# EAGLE design XBee-Explorer (EAGLE 6.5.0)
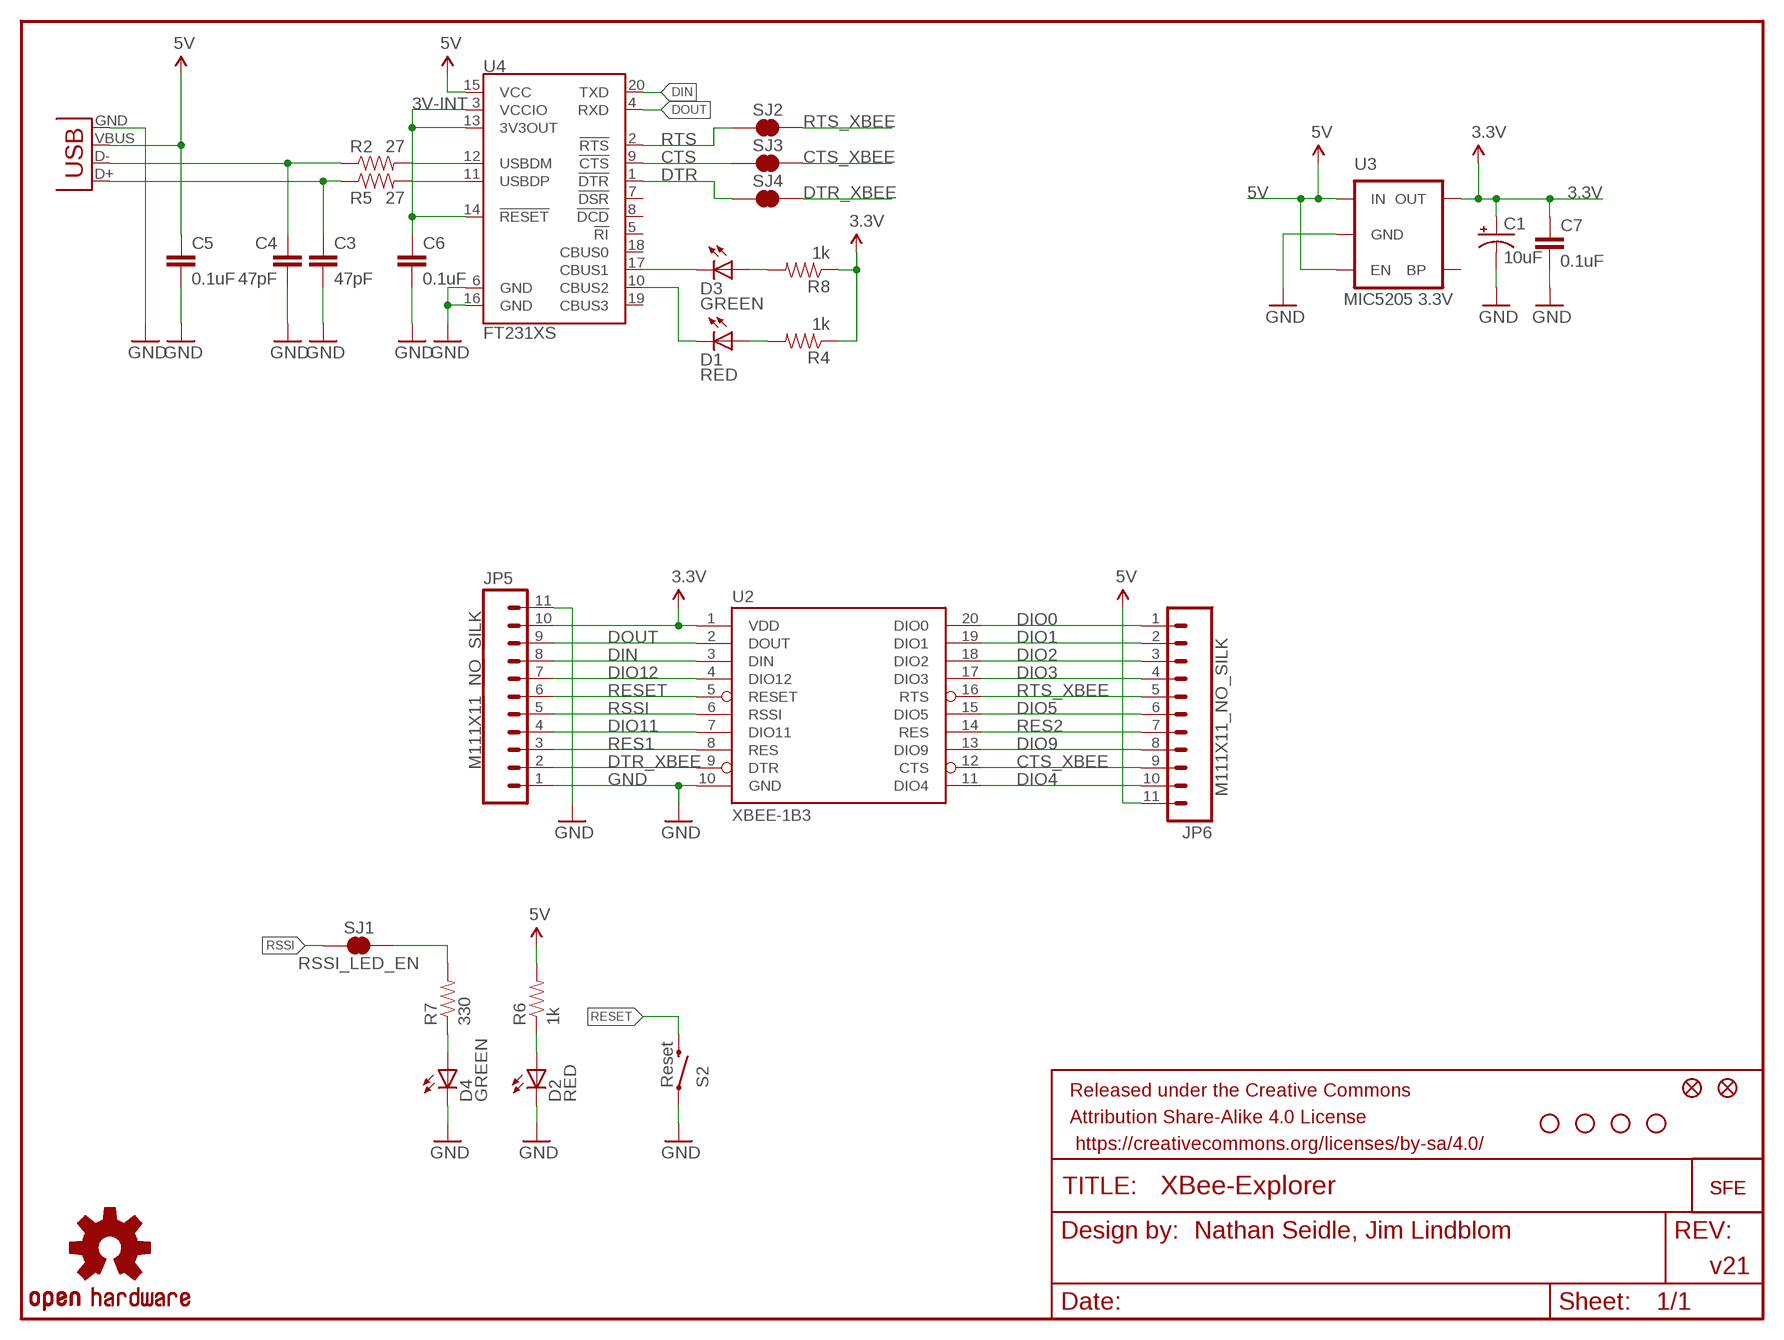
[diagram p0: schematic, sheet 1]

## Parts
C1  10uF  CAP_POL1206  [EIA3216]
C3  47pF  CAP0603-CAP  [0603-CAP]
C4  47pF  CAP0603-CAP  [0603-CAP]
C5  0.1uF  CAP0603-CAP  [0603-CAP]
C6  0.1uF  CAP0603-CAP  [0603-CAP]
C7  0.1uF  CAP0603-CAP  [0603-CAP]
D1  RED  LED-RED0603  [LED-0603]
D2  RED  LED-RED0603  [LED-0603]
D3  GREEN  LED-GREEN0603  [LED-0603]
D4  GREEN  LED-GREEN0603  [LED-0603]
FRAME1  FRAME-LETTER  [CREATIVE_COMMONS]
JP1  FIDUCIAL1X2  [FIDUCIAL-1X2]
JP4  FIDUCIAL1X2  [FIDUCIAL-1X2]
JP5  M111X11_NO_SILK  [1X11_NO_SILK]
JP6  M111X11_NO_SILK  [1X11_NO_SILK]
LOGO1  OSHW-LOGOS  [OSHW-LOGO-S]
R2  27  RESISTOR0603-RES  [0603-RES]
R4  1k  RESISTOR0603-RES  [0603-RES]
R5  27  RESISTOR0603-RES  [0603-RES]
R6  1k  RESISTOR0603-RES  [0603-RES]
R7  330  RESISTOR0603-RES  [0603-RES]
R8  1k  RESISTOR0603-RES  [0603-RES]
S2  Reset  SWITCH-MOMENTARY-2SMD  [TACTILE_SWITCH_SMD]
SJ1  RSSI_LED_EN  SOLDERJUMPERTRACE  [SJ_2S-TRACE]
SJ2  CTS_EN  SOLDERJUMPERTRACE  [SJ_2S-TRACE]
SJ3  RTS_EN  SOLDERJUMPERTRACE  [SJ_2S-TRACE]
SJ4  DTR  SOLDERJUMPERTRACE  [SJ_2S-TRACE]
U2  XBEE-1B3  [XBEE-SMD]
U3  MIC5205 3.3V  V_REG_LDOSMD  [SOT23-5]
U4  FT231XS  [SSOP20_L]
U$1  LOGO-SFESK  [SFE-LOGO-FLAME]
U$4  LOGO-SFENEW  [SFE-NEW-WEBLOGO]
U$5  STAND-OFF  [STAND-OFF]
U$9  STAND-OFF  [STAND-OFF]
U$10  STAND-OFF  [STAND-OFF]
U$11  STAND-OFF  [STAND-OFF]
X1  USBSMD  [USB-MINIB]

## Nets
3.3V: C1.A(+) C7.1 JP5.10 R4.1 R8.1 U2.1(VDD) U3.5(OUT)
3V-INT: C6.1 U4.3(VCCIO) U4.13(3V3OUT) U4.14(!RESET)
5V: C5.1 JP6.11 R6.2 U3.1(IN) U3.3(EN) U4.15(VCC) X1.VBUS
CTS: SJ3.1 U4.9(!CTS)
CTS_XBEE: JP6.9 SJ3.2 U2.12(CTS)
DIN: JP5.8 U2.3(DIN) U4.20(TXD)
DIO0: JP6.1 U2.20(DIO0)
DIO1: JP6.2 U2.19(DIO1)
DIO2: JP6.3 U2.18(DIO2)
DIO3: JP6.4 U2.17(DIO3)
DIO4: JP6.10 U2.11(DIO4)
DIO5: JP6.6 U2.15(DIO5)
DIO9: JP6.8 U2.13(DIO9)
DIO11: JP5.4 U2.7(DIO11)
DIO12: JP5.7 U2.4(DIO12)
DOUT: JP5.9 U2.2(DOUT) U4.4(RXD)
DTR: SJ4.1 U4.1(!DTR)
DTR_XBEE: JP5.2 SJ4.2 U2.9(DTR)
GND: C1.C(-) C3.2 C4.2 C5.2 C6.2 C7.2 D2.C D4.C JP5.1 JP5.11 S2.1 U2.10(GND) U3.2(GND) U4.6(GND) U4.16(GND) X1.GND
N$1: D1.A R4.2
N$2: D4.A R7.1
N$3: C3.1 R5.1 X1.D+
N$4: D3.A R8.2
N$5: C4.1 R2.1 X1.D-
N$6: D3.C U4.17(CBUS1)
N$7: R5.2 U4.11(USBDP)
N$8: R2.2 U4.12(USBDM)
N$9: R7.2 SJ1.2
N$38: D2.A R6.1
RES1: JP5.3 U2.8(RES)
RES2: JP6.7 U2.14(RES)
RESET: JP5.6 S2.3 U2.5(RESET)
RSSI: JP5.5 SJ1.1 U2.6(RSSI)
RTS: SJ2.1 U4.2(!RTS)
RTS_XBEE: JP6.5 SJ2.2 U2.16(RTS)
TXLED: D1.C U4.10(CBUS2)
Unconnected: U3.4(BP) U4.5(!RI) U4.7(!DSR) U4.8(!DCD) U4.18(CBUS0) U4.19(CBUS3)

## Notes on the sheet
- Nathan Seidle, Jim Lindblom
- v21

## Library data of the parts
C1 = SparkFun:CAP_POL: Capacitor Polarized These are standard SMD and PTH capacitors. Normally 10uF, 47uF, and 100uF in electrolytic and tantalum varieties. Always verify the external diameter of the through hole cap, it varies with capacity, voltage, and manufacturer. The EIA devices should be standard.
C3-C7 = SparkFun-Capacitors:CAP: Capacitor Standard 0603 ceramic capacitor, and 0.1" leaded capacitor.
D1 D2 = SparkFun-LED:LED-RED: Assorted Red LEDs LilyPad 1206- DIO-09912 1206- DIO-00809 0603- DIO-00819; PROD_ID: DIO-00819
D3 D4 = SparkFun-LED:LED-GREEN: Various green LEDs Green LEDs used in SFE Production 0603- DIO-00821 LARGE- DIO-00862 LILYPAD- DIO-09910; PROD_ID: DIO-00821
FRAME1 = SparkFun-Aesthetics:FRAME-LETTER: Schematic Frame Standard 8.5x11 US Letter frame
JP1 JP4 = SparkFun:FIDUCIAL: Fiducial Alignment Points Various fiducial points for machine vision alignment.
JP5 JP6 = SparkFun-Connectors:M11: Header 11 Standard 11-pin 0.1" header. Use with straight break away headers (SKU : PRT-00116), right angle break away headers (PRT-00553), swiss pins (PRT-00743), machine pins (PRT-00117), and female headers (PRT-00115).
LOGO1 = SparkFun-Aesthetics:OSHW-LOGO: Open Source Hardware Logo This logo indicates the piece of hardware it is found on incorporates a OSHW license and/or adheres to the definition of open source hardware found here: http://freedomdefined.org/OSHW
R2 R4-R8 = SparkFun-Resistors:RESISTOR: Resistor Basic schematic elements and footprints for 0603, 1206, and PTH resistors.
S2 = SparkFun-Electromechanical:SWITCH-MOMENTARY-2: Various NO switches- pushbuttons, reed, etc; PROD_ID: SWCH-08247
SJ1-SJ4 = SparkFun-Passives:SOLDERJUMPER: Solder Jumper Standard SMD solder jumper. Used to automate production. Two varients : Normally Open and Normally Closed are the same, but have different paste layers. NC will have a large amount of paste and should jumper during reflow.
U2 = SparkFun:XBEE-1
U3 = SparkFun:V_REG_LDO: Voltage Regulator LDO Standard 150mA LDO voltage regulator in SOT-23 layout. Micrel part MIC5205. BP (by-pass) pin is used to lower output noise with 470pF cap.
U4 = SparkFun-DigitalIC:FT231X: FTDI FT231X Full Speed USB to Full-handshake UART This USB2.0 Full Speed IC offers a compact bridge to full handshake UART interfaces. The device is a UART, capable of operating up to 3MBaud, with low power consumption (8mA). The FT231X includes the complete FT-X series feature set and enables USB to be added into a system design quickly and easily over a UART interface.
U$1 U$4 = SparkFun:LOGO-SFE: Spark Fun Electronics PCB Logo This is the standard Spark Fun Electronics PCB logo.
U$5 U$9-U$11 = SparkFun:STAND-OFF: Stand Off This is the mechanical footprint for a #4 phillips button head screw. Use the keepout ring to avoid running the screw head into surrounding components. SKU : PRT-00447
X1 = SparkFun:USB: USB Connectors USB-B-PTH is fully proven SKU : PRT-00139 USB-miniB is fully proven SKU : PRT-00587 USB-A-PCB is untested. USB-A-H is throughly reviewed, but untested. Spark Fun Electronics SKU : PRT-00437 USB-B-SMT is throughly reviewed, but untested. Needs silkscreen touching up. USB-A-S has not been used/tested USB-MB-H has not been used/tested

## Net classes
0 default: width 0.203 mm
1 vcc: width 0.305 mm
2 gnd: width 0.254 mm

## Board
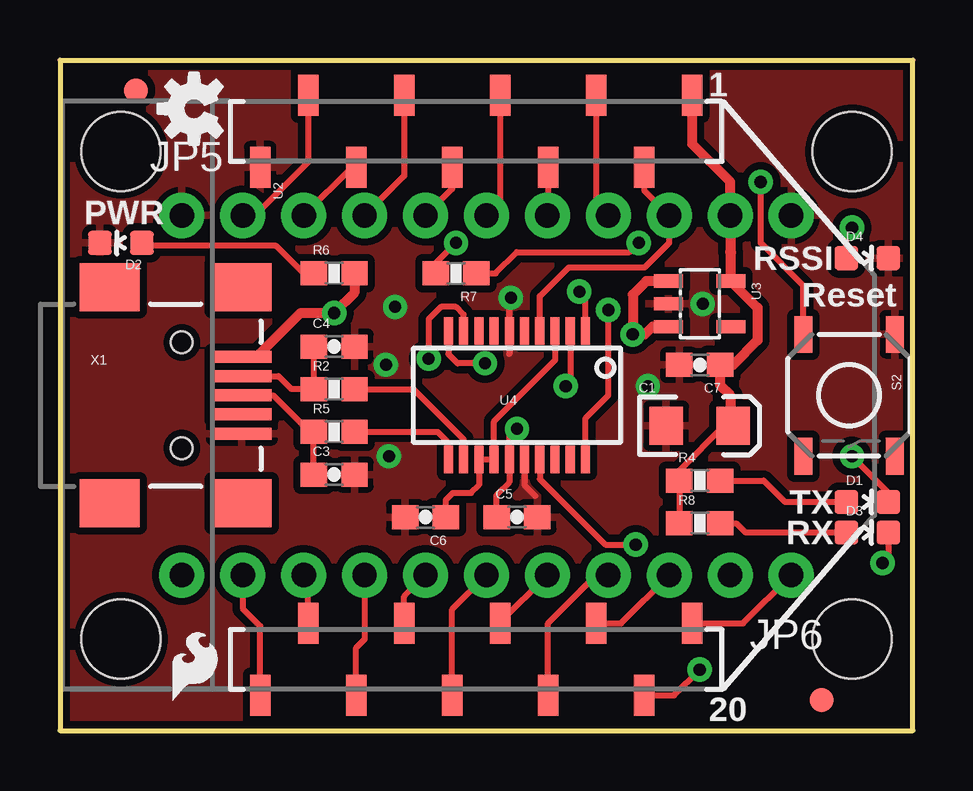
[diagram p1: board, top side]
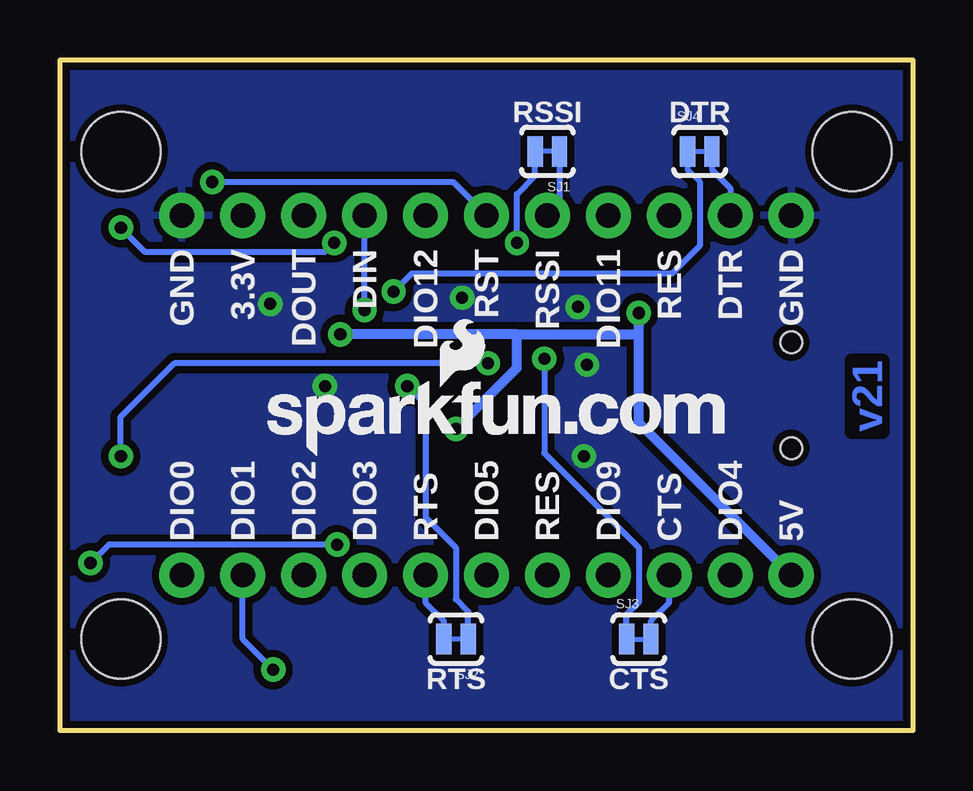
[diagram p2: board, bottom side, seen from below]

Size 35.56 x 27.94 mm. Coordinates in mm from the lower left corner, seen from the top.
Outline: 35.56,0 35.56,27.94 0,27.94 0,0 35.56,0
Copper layers (1*16): Top 0.035mm / dielectric 1.5mm / Bottom 0.035mm
Design rules "SparkFun-2-layer": minimum track width 7mil, minimum drill 15mil, track to track 8mil, track to pad 8mil, pad to pad 8mil, via to via 8mil, smd to smd 8mil, copper to edge 8mil, drill to drill 8mil, minimum pad ring 12mil, minimum via ring 10mil, stop-mask expansion 4mil, vias tented up to drill 20mil, thermal gap 10mil

### Footprints (pad centres in the part's own frame; a part is rotated, then mirrored left to right if it is on the bottom)
EIA3216 = smd 1.4 x 1.6: A 1.4,0; C -1.4,0
0603-CAP = smd 1.1 x 1: 1 -0.85,0; 2 0.85,0
LED-0603 = smd 1 x 1: A 0,-0.877; C 0,0.877
FIDUCIAL-1X2 = smd 1 x 1: 1 0,0
1X11_NO_SILK = drill 1.016 pad 1.88: 1 0,0; 2 2.54,0; 3 5.08,0; 4 7.62,0; 5 10.16,0; 6 12.7,0; 7 15.24,0; 8 17.78,0; 9 20.32,0; 10 22.86,0; 11 25.4,0
0603-RES = smd 1.1 x 1: 1 -0.85,0; 2 0.85,0
TACTILE_SWITCH_SMD = smd 1.524 x 0.762: 1 -2.54,1.905; 2 2.54,1.905; 3 -2.54,-1.905; 4 2.54,-1.905
SJ_2S-TRACE = smd 0.635 x 1.27: 1 -0.508,0; 2 0.508,0
XBEE-SMD = smd 1.7 x 0.85: 1 -12.5,20; 2 -9.5,18; 3 -12.5,16; 4 -9.5,14; 5 -12.5,12; 6 -9.5,10; 7 -12.5,8; 8 -9.5,6; 9 -12.5,4; 10 -9.5,2; 11 12.5,2; 12 9.5,4; 13 12.5,6; 14 9.5,8; 15 12.5,10; 16 9.5,12; 17 12.5,14; 18 9.5,16; 19 12.5,18; 20 9.5,20
SOT23-5 = smd 0.55 x 1.2: 1 -0.95,-1.3; 2 0,-1.3; 3 0.95,-1.3; 4 0.95,1.3; 5 -0.95,1.3
SSOP20_L = smd 0.381 x 1.143: 1 -2.857,-2.68; 2 -2.223,-2.68; 3 -1.587,-2.68; 4 -0.953,-2.68; 5 -0.318,-2.68; 6 0.318,-2.68; 7 0.953,-2.68; 8 1.587,-2.68; 9 2.223,-2.68; 10 2.857,-2.68; 11 2.857,2.68; 12 2.223,2.68; 13 1.587,2.68; 14 0.953,2.68; 15 0.318,2.68; 16 -0.318,2.68; 17 -0.953,2.68; 18 -1.587,2.68; 19 -2.223,2.68; 20 -2.857,2.68
STAND-OFF = hole 3.302: 0,0
USB-MINIB = smd 2.5 x 0.5: D+ 2.5,0; D- 2.5,0.8; GND 2.5,-1.6; ID 2.5,-0.8; VBUS 2.5,1.6 | smd 2.5 x 2: GND@1 -3,-4.5; GND@2 -3,4.5; GND@3 2.5,4.5; GND@4 2.5,-4.5 | hole 0.9: 0,2.2; 0,-2.2

### Placement (x,y rotation side)
C1  26.67,12.7 0 top
C3  11.43,10.67 0 top
C4  11.43,16 0 top
C5  19.05,8.89 0 top
C6  15.24,8.89 180 top
C7  26.67,15.24 180 top
D1  33.66,9.53 270 top
D2  2.54,20.32 90 top
D3  33.66,8.26 270 top
D4  33.66,19.68 270 top
FRAME1  -12.7,-10.16 0 top  (outside the outline)
JP1  31.75,1.27 0 top
JP4  3.17,26.67 0 top
JP5  5.08,21.46 0 top
JP6  30.48,6.48 180 top
LOGO1  5.59,25.91 90 top
R2  11.43,14.22 0 top
R4  26.67,10.41 0 top
R5  11.43,12.45 0 top
R6  11.43,19.05 0 top
R7  16.51,19.05 180 top
R8  26.67,8.64 0 top
S2  32.89,13.97 270 top
SJ1  15.24,24.13 180 bottom
SJ2  19.05,3.81 180 bottom
SJ3  11.43,3.81 0 bottom
SJ4  8.89,24.13 0 bottom
U2  6.35,13.97 270 top
U3  MIC5219 3.3V  [SOT23-5]  26.67,17.78 270 top
U4  19.05,13.97 180 top
U$1  4.7,1.27 0 top
U$4  26.92,11.43 0 bottom
U$5  2.54,3.81 0 top
U$9  2.54,24.13 0 top
U$10  33.02,24.13 0 top
U$11  33.02,3.81 0 top
X1  5.08,13.97 0 top

### Tracks (layer width: path | path; a pad name or v marks a point on that pad's centre or on a via)
3.3V
  Top 0.254: R8.1 R4.1 25.82,10.83 27.69,12.7 C1.A
  Top 0.406: U2.1 26.35,24.45 27.94,22.86 JP5.10 27.94,19.94 27.97,19.91 U3.5 29.08,17.62 29.08,16.26 28.07,15.24 C7.1 27.52,14.39 27.94,13.97 27.94,12.83 C1.A
3V-INT
  Top 0.254: C6.1 16.09,9.61 16.38,9.91 17.14,9.91 17.46,10.22 U4.13 U4.14 18.1,12.89 20.64,15.43 U4.3
5V  (via drill 0.51)
  Top 0.254: v19.05,12.57 18.73,12.26 U4.15 18.73,10.35 18.2,9.82 C5.1
  Top 0.406: X1.VBUS 8.2,15.57 10.03,17.4 v11.43,17.4 12.28,18.25 R6.2 | U3.3 24.7,16.83 24.38,16.51 v23.88,16.51 23.88,18.16 24.45,18.73 U3.1
  Bottom 0.406: 16.51,16.51 v23.88,16.51 | v19.05,12.57 16.51,15.11 16.51,16.51 | 11.43,16.51 11.43,12.83 JP6.11 | 11.43,16.51 v11.43,17.4 | 16.51,16.51 11.43,16.51
CTS  (via drill 0.51)
  Top 0.254: U4.9 16.83,17.34 16.51,17.65 15.88,17.65 15.37,17.14 v15.37,15.49
  Bottom 0.254: v15.37,15.49 15.37,11.56 11.43,7.62 11.43,5.33 11.94,4.83 SJ3.1
CTS_XBEE
  Top 0.254: U2.12 10.35,6.29 JP6.9
  Bottom 0.254: SJ3.2 10.92,4.57 10.16,5.33 JP6.9
DIN  (via drill 0.51)
  Top 0.254: U2.3 22.35,21.97 JP5.8 | U4.20 21.91,13.02 22.86,13.97 v22.86,17.53
  Bottom 0.254: v22.86,17.53 JP5.8
DIO0
  Top 0.254: U2.20 28.47,4.47 JP6.1
DIO1  (via drill 0.51)
  Top 0.254: U2.19 25.6,1.47 v26.67,2.54
  Bottom 0.254: v26.67,2.54 27.94,3.81 JP6.2
DIO2
  Top 0.254: U2.18 23.39,4.47 JP6.3
DIO3
  Top 0.254: U2.17 20.35,4.47 22.35,6.48 JP6.4
DIO4
  Top 0.254: JP6.10 7.62,5.08 8.35,4.35 U2.11
DIO5
  Top 0.254: U2.15 16.35,5.05 JP6.6
DIO9
  Top 0.254: U2.13 12.35,3.46 12.7,3.81 JP6.8
DIO11
  Top 0.254: JP5.4 14.35,23.11 U2.7
DIO12
  Top 0.254: U2.4 20.35,21.49 JP5.7
DOUT
  Top 0.254: U2.2 24.35,22.51 JP5.9 25.4,20.32 24.38,19.3 21.21,19.3 20,18.1 U4.4
DTR  (via drill 0.51)
  Top 0.254: U4.1 21.91,18.03 v21.65,18.29
  Bottom 0.254: v21.65,18.29 20.89,19.05 10.03,19.05 8.89,20.19 8.89,22.86 9.4,23.37 SJ4.1
DTR_XBEE
  Top 0.254: JP5.2 8.13,21.46 10.35,23.68 U2.9
  Bottom 0.254: SJ4.2 8.38,23.37 7.62,22.61 JP5.2
GND  (via drill 0.51)
  Top 0.254: U4.16 19.37,10.22 19.81,9.78 | 18.73,15.68 U4.6 18.73,17.97 v18.8,18.03
  other vias: 24.51,14.35 13.72,11.43 13.59,15.24 26.8,17.78 13.97,17.65
  pour Bottom (isolate 0.305): 0,27.94 35.56,27.94 35.56,0 0,0
  pour Top (isolate 0.305): 0,27.94 35.56,27.94 35.56,0 0,0
N$1
  Top 0.254: R4.2 29.34,10.41 30.23,9.53 D1.A
N$2  (via drill 0.51)
  Top 0.254: R7.1 18.16,19.05 19.05,19.94 23.75,19.94 v24.13,20.32 | D4.A 32.78,20.71 v33.02,20.95
  Bottom 0.254: v24.13,20.32 24.51,19.94 32,19.94 v33.02,20.95
N$3
  Top 0.254: C3.1 R5.1 10.41,12.45 8.89,13.97 X1.D+
N$4
  Top 0.254: R8.2 28.19,8.64 28.57,8.26 D3.A
N$5
  Top 0.254: C4.1 R2.1 9.65,14.22 9.11,14.77 X1.D-
N$6  (via drill 0.51)
  Top 0.254: U4.17 20,10.48 22.73,7.75 v24,7.75 | D3.C 34.53,7.23 v34.29,6.99
  Bottom 0.254: v24,7.75 33.53,7.75 v34.29,6.99
N$7
  Top 0.254: R5.2 15.75,12.45 16.19,12 U4.11
N$8
  Top 0.254: R2.2 14.73,14.22 16.83,12.13 U4.12
N$9  (via drill 0.51)
  Top 0.254: R7.2 15.66,19.47 v16.51,20.32
  Bottom 0.254: v16.51,20.32 16.51,22.35 15.75,23.11 SJ1.2
N$38
  Top 0.254: R6.1 10.16,19.05 9.02,20.19 3.54,20.19 D2.A
RES1
  Top 0.254: JP5.3 12.17,23.47 U2.8
RES2
  Top 0.254: U2.14 14.35,5.59 JP6.7
RESET  (via drill 0.51)
  Top 0.254: U2.5 18.35,22.03 JP5.6 | S2.3 30.99,18.54 29.21,20.32 v29.21,22.86
  Bottom 0.254: v29.21,22.86 19.18,22.86 JP5.6
RSSI
  Top 0.254: U2.6 16.35,22.57 JP5.5
  Bottom 0.254: SJ1.1 14.73,21.97 JP5.5
RTS  (via drill 0.51)
  Top 0.254: U4.2 21.27,14.54 v21.08,14.35
  Bottom 0.254: v21.08,14.35 20.32,13.59 20.32,8.89 19.05,7.62 19.05,5.46 18.54,4.95 SJ2.1
RTS_XBEE
  Top 0.254: U2.16 18.35,4.51 JP6.5
  Bottom 0.254: SJ2.2 19.56,4.57 20.32,5.33 JP6.5
TXLED  (via drill 0.51)
  Top 0.254: U4.10 16.19,15.68 16.57,15.3 v17.72,15.3 | v33.02,11.43 34.53,9.92 D1.C
  Bottom 0.254: v17.72,15.3 30.8,15.3 33.02,13.08 v33.02,11.43

### Text on the board
Bottom: v21
tPlace: 1 | PWR | RSSI | Reset | TX | RX | 20
bPlace: DTR | RSSI | GND | DTR | RES | DIO11 | RSSI | RST | DIO12 | DIN | DOUT | 3.3V | GND | 5V | DIO4 | CTS | DIO9 | RES | DIO5 | RTS | DIO3 | DIO2 | DIO1 | DIO0 | CTS | RTS
tValues: XBee Socket Up | DNP | DNP | XBee Socket Up | N. Seidle
tDocu: Nathan Seidle, Jim Lindblom